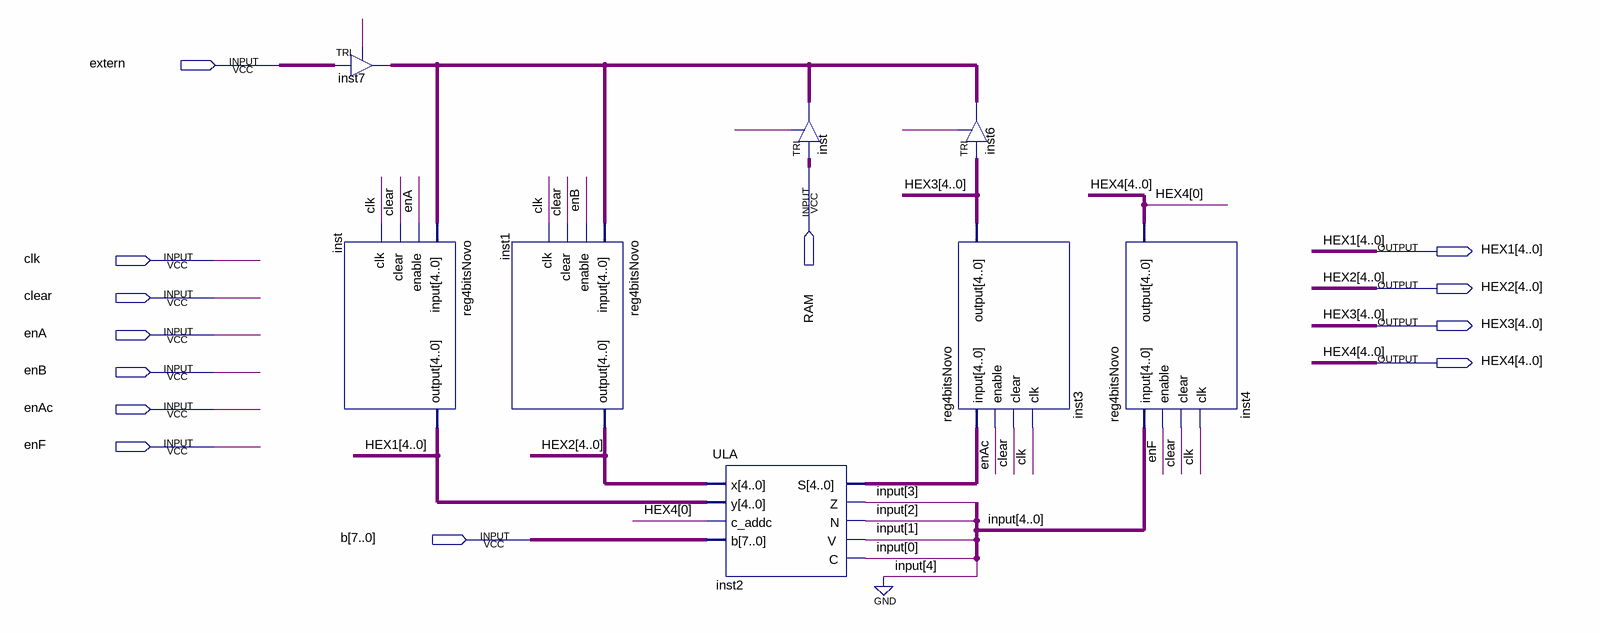
[diagram p0: schematic sheet]
// Quartus schematic circuitoRegsULA.bdf as structural Verilog: 8 symbols, 13 pins
module circuitoRegsULA (
  input  \extern ,
  input  RAM,
  input  clk,
  input  clear,
  input  enA,
  input  enB,
  input  enAc,
  input  enF,
  input  [7:0] b,
  output [4:0] HEX1,
  output [4:0] HEX2,
  output [4:0] HEX3,
  output [4:0] HEX4
);

  wire undriven, undriven_3, undriven_4;
  wire [3:0] \input ;
  wire [4:0] inst2_s, inst7_out, undriven_2, undriven_5;

  TRI inst7[4:0] (.IN(undriven_2), .OE(undriven_3), .OUT(inst7_out));
  reg4bitsNovo inst (.\input (inst7_out), .enable(enA), .clear(clear), .clk(clk), .\output (HEX1));
  reg4bitsNovo inst1 (.\input (inst7_out), .enable(enB), .clear(clear), .clk(clk), .\output (HEX2));
  ULA inst2 (
    .x(HEX2), .y(HEX1), .c_addc(HEX4[0]), .b(b), .S(inst2_s), .Z(\input [3]), .N(\input [2]), .V(\input [1]),
    .C(\input [0]));
  TRI inst_dup2[4:0] (.IN(undriven_5), .OE(undriven_4), .OUT(inst7_out));
  reg4bitsNovo inst3 (.\input (inst2_s), .enable(enAc), .clear(clear), .clk(clk), .\output (HEX3));
  TRI inst6[4:0] (.IN(HEX3), .OE(undriven), .OUT(inst7_out));
  reg4bitsNovo inst4 (.\input ({1'b0, \input }), .enable(enF), .clear(clear), .clk(clk), .\output (HEX4));
endmodule
